# Altium schematic sheet 08-DDR3-256MX32.SchDoc
size 513 x 386 mm
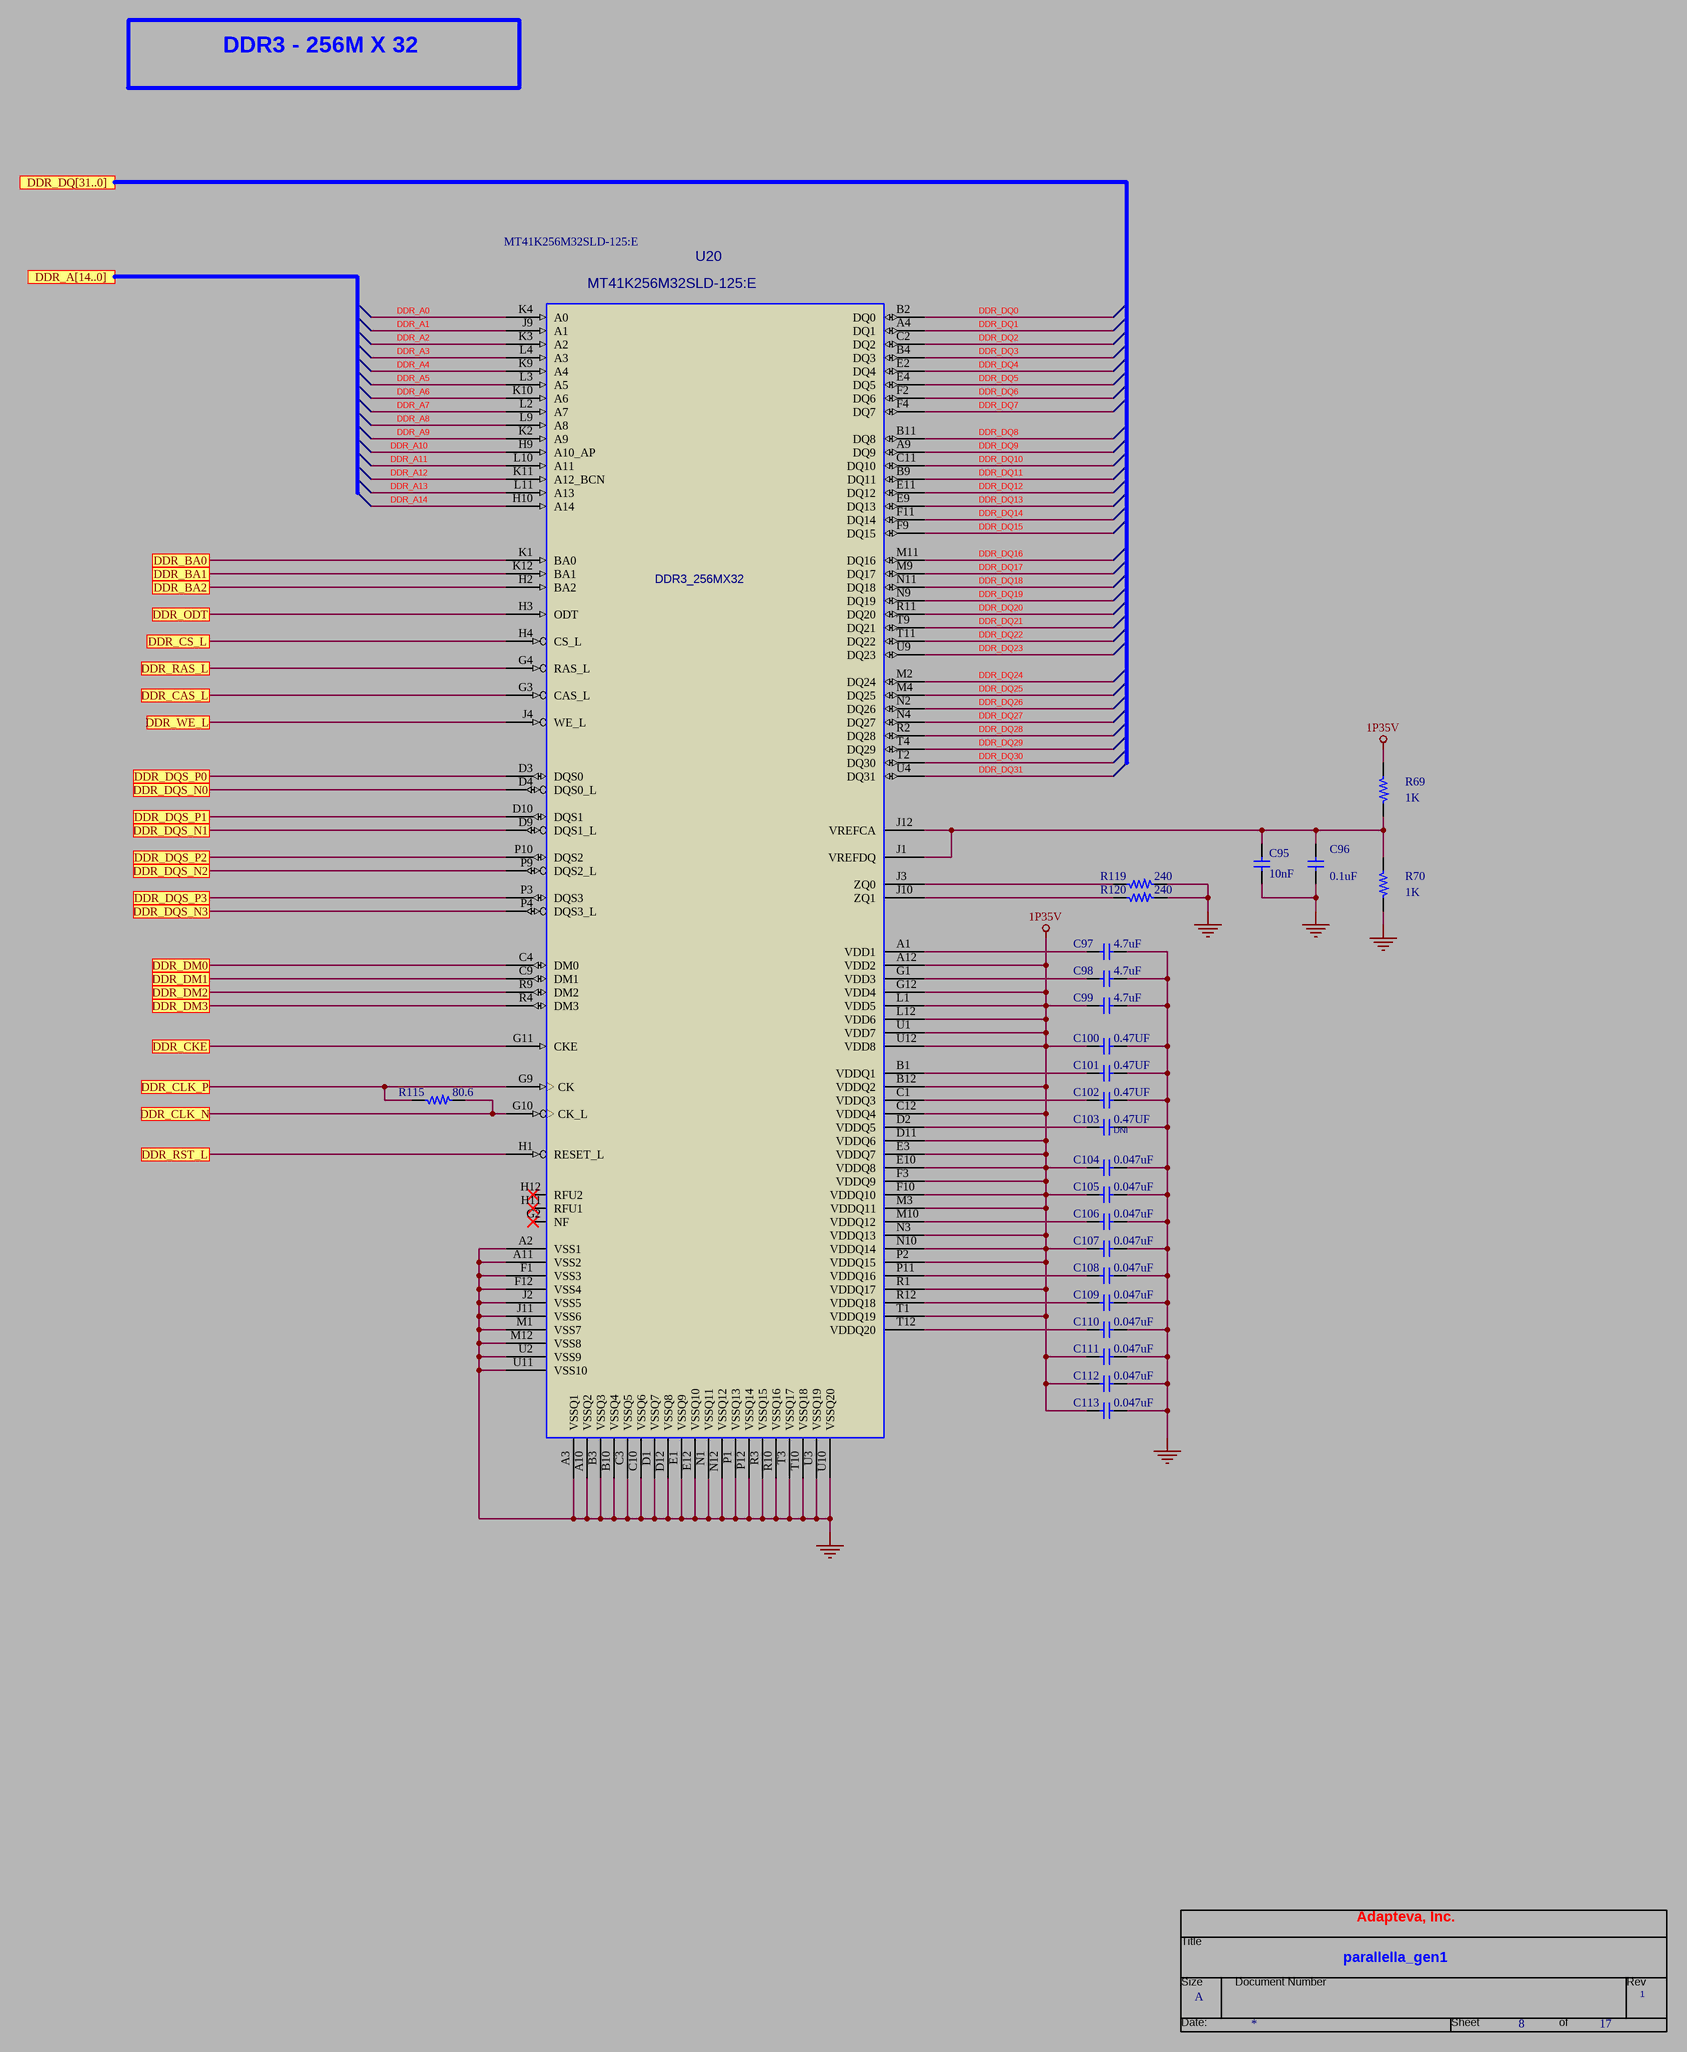
[diagram p0: 08-DDR3-256MX32.SchDoc]

## Parts
*  RevCode: 1  Title: parallella_gen1  Page Size: A  Page Number: 8  Page Count: 17  OrgAddr1: Adapteva, Inc.  (hidden comment: TitleBlock0)  (graphical)
C95  10nF  [C0402]
C96  0.1uF  [C0402]
C97  4.7uF  [C0402]
C98  4.7uF  [C0402]
C99  4.7uF  [C0402]
C100  0.47UF  [C0402]
C101  0.47UF  [C0402]
C102  0.47UF  [C0402]
C103  0.47UF  INSTALL: DNI  [C0402]
C104  0.047uF  [C0402]
C105  0.047uF  [C0402]
C106  0.047uF  [C0402]
C107  0.047uF  [C0402]
C108  0.047uF  [C0402]
C109  0.047uF  [C0402]
C110  0.047uF  [C0402]
C111  0.047uF  [C0402]
C112  0.047uF  [C0402]
C113  0.047uF  [C0402]
R69  1K  [R0402]
R70  1K  [R0402]
R115  80.6  [R0402]
R119  240  [R0402]
R120  240  [R0402]
U20  DDR3_256MX32  Vendor PN: MT41K256M32SLD-125:E  [FBGA136_11X14X1P1_P8MMP]

## Ports
DDR_A[14..0], DDR_BA0, DDR_BA1, DDR_BA2, DDR_CAS_L, DDR_CKE, DDR_CLK_N, DDR_CLK_P, DDR_CS_L, DDR_DM0, DDR_DM1, DDR_DM2, DDR_DM3, DDR_DQ[31..0], DDR_DQS_N0, DDR_DQS_N1, DDR_DQS_N2, DDR_DQS_N3, DDR_DQS_P0, DDR_DQS_P1, DDR_DQS_P2, DDR_DQS_P3, DDR_ODT, DDR_RAS_L, DDR_RST_L, DDR_WE_L

## Nets
1P35V: C99.1 C100.1 C104.1 C105.1 C107.1 C111.1 C112.1 C113.1 R69.1 U20.A12(VDD2) U20.B12(VDDQ2) U20.C12(VDDQ4) U20.D11(VDDQ6) U20.E3(VDDQ7) U20.E10(VDDQ8) U20.F3(VDDQ9) U20.F10(VDDQ10) U20.G12(VDD4) U20.L1(VDD5) U20.L12(VDD6) U20.M3(VDDQ11) U20.N3(VDDQ13) U20.N10(VDDQ14) U20.P2(VDDQ15) U20.R1(VDDQ17) U20.T1(VDDQ19) U20.U1(VDD7) U20.U12(VDD8)
GND: C95.2 C96.1 C97.2 C98.2 C99.2 C100.2 C101.2 C102.2 C103.2 C104.2 C105.2 C106.2 C107.2 C108.2 C109.2 C110.2 C111.2 C112.2 C113.2 R70.2 R119.2 R120.2 U20.A2(VSS1) U20.A3(VSSQ1) U20.A10(VSSQ2) U20.A11(VSS2) U20.B3(VSSQ3) U20.B10(VSSQ4) U20.C3(VSSQ5) U20.C10(VSSQ6) U20.D1(VSSQ7) U20.D12(VSSQ8) U20.E1(VSSQ9) U20.E12(VSSQ10) U20.F1(VSS3) U20.F12(VSS4) U20.J2(VSS5) U20.J11(VSS6) U20.M1(VSS7) U20.M12(VSS8) U20.N1(VSSQ11) U20.N12(VSSQ12) U20.P1(VSSQ13) U20.P12(VSSQ14) U20.R3(VSSQ15) U20.R10(VSSQ16) U20.T3(VSSQ17) U20.T10(VSSQ18) U20.U2(VSS9) U20.U3(VSSQ19) U20.U10(VSSQ20) U20.U11(VSS10)
DDR_A0: U20.K4(A0)
DDR_A1: U20.J9(A1)
DDR_A2: U20.K3(A2)
DDR_A3: U20.L4(A3)
DDR_A4: U20.K9(A4)
DDR_A5: U20.L3(A5)
DDR_A6: U20.K10(A6)
DDR_A7: U20.L2(A7)
DDR_A8: U20.L9(A8)
DDR_A9: U20.K2(A9)
DDR_A10: U20.H9(A10_AP)
DDR_A11: U20.L10(A11)
DDR_A12: U20.K11(A12_BCN)
DDR_A13: U20.L11(A13)
DDR_A14: U20.H10(A14)
DDR_BA0: U20.K1(BA0) ; port DDR_BA0
DDR_BA1: U20.K12(BA1) ; port DDR_BA1
DDR_BA2: U20.H2(BA2) ; port DDR_BA2
DDR_CAS_L: U20.G3(CAS_L) ; port DDR_CAS_L
DDR_CKE: U20.G11(CKE) ; port DDR_CKE
DDR_CLK_N: R115.2 U20.G10(CK_L) ; port DDR_CLK_N
DDR_CLK_P: R115.1 U20.G9(CK) ; port DDR_CLK_P
DDR_CS_L: U20.H4(CS_L) ; port DDR_CS_L
DDR_DM0: U20.C4(DM0) ; port DDR_DM0
DDR_DM1: U20.C9(DM1) ; port DDR_DM1
DDR_DM2: U20.R9(DM2) ; port DDR_DM2
DDR_DM3: U20.R4(DM3) ; port DDR_DM3
DDR_DQ0: U20.B2(DQ0)
DDR_DQ1: U20.A4(DQ1)
DDR_DQ2: U20.C2(DQ2)
DDR_DQ3: U20.B4(DQ3)
DDR_DQ4: U20.E2(DQ4)
DDR_DQ5: U20.E4(DQ5)
DDR_DQ6: U20.F2(DQ6)
DDR_DQ7: U20.F4(DQ7)
DDR_DQ8: U20.B11(DQ8)
DDR_DQ9: U20.A9(DQ9)
DDR_DQ10: U20.C11(DQ10)
DDR_DQ11: U20.B9(DQ11)
DDR_DQ12: U20.E11(DQ12)
DDR_DQ13: U20.E9(DQ13)
DDR_DQ14: U20.F11(DQ14)
DDR_DQ15: U20.F9(DQ15)
DDR_DQ16: U20.M11(DQ16)
DDR_DQ17: U20.M9(DQ17)
DDR_DQ18: U20.N11(DQ18)
DDR_DQ19: U20.N9(DQ19)
DDR_DQ20: U20.R11(DQ20)
DDR_DQ21: U20.T9(DQ21)
DDR_DQ22: U20.T11(DQ22)
DDR_DQ23: U20.U9(DQ23)
DDR_DQ24: U20.M2(DQ24)
DDR_DQ25: U20.M4(DQ25)
DDR_DQ26: U20.N2(DQ26)
DDR_DQ27: U20.N4(DQ27)
DDR_DQ28: U20.R2(DQ28)
DDR_DQ29: U20.T4(DQ29)
DDR_DQ30: U20.T2(DQ30)
DDR_DQ31: U20.U4(DQ31)
DDR_DQS_N0: U20.D4(DQS0_L) ; port DDR_DQS_N0
DDR_DQS_N1: U20.D9(DQS1_L) ; port DDR_DQS_N1
DDR_DQS_N2: U20.P9(DQS2_L) ; port DDR_DQS_N2
DDR_DQS_N3: U20.P4(DQS3_L) ; port DDR_DQS_N3
DDR_DQS_P0: U20.D3(DQS0) ; port DDR_DQS_P0
DDR_DQS_P1: U20.D10(DQS1) ; port DDR_DQS_P1
DDR_DQS_P2: U20.P10(DQS2) ; port DDR_DQS_P2
DDR_DQS_P3: U20.P3(DQS3) ; port DDR_DQS_P3
DDR_ODT: U20.H3(ODT) ; port DDR_ODT
DDR_RAS_L: U20.G4(RAS_L) ; port DDR_RAS_L
DDR_RST_L: U20.H1(RESET_L) ; port DDR_RST_L
DDR_WE_L: U20.J4(WE_L) ; port DDR_WE_L
NetC95_1: C95.1 C96.2 R69.2 R70.1 U20.J1(VREFDQ) U20.J12(VREFCA)
NetC97_1: C97.1 U20.A1(VDD1)
NetC98_1: C98.1 U20.G1(VDD3)
NetC101_1: C101.1 U20.B1(VDDQ1)
NetC102_1: C102.1 U20.C1(VDDQ3)
NetC103_1: C103.1 U20.D2(VDDQ5)
NetC106_1: C106.1 U20.M10(VDDQ12)
NetC108_1: C108.1 U20.P11(VDDQ16)
NetC109_1: C109.1 U20.R12(VDDQ18)
NetC110_1: C110.1 U20.T12(VDDQ20)
NetR119_1: R119.1 U20.J3(ZQ0)
NetR120_1: R120.1 U20.J10(ZQ1)

Not connected (* = marked no-connect by the designer): U20 G2(NF)* H11(RFU1)* H12(RFU2)*

## Notes on the sheet
- DDR3 - 256M X 32
- (in symbol TitleBlock0) Title; Size; Document Number; Rev; Date:; Sheet; of

## Library data of the parts
C95 = CAP0402_10NF_X7R_16V: CAP, 0402, 10NF, X7R, 16V; MFG PART NO: C1005X7R1C103K; MFG: TDK; ALT_SYMBOLS: C0402_BGA; Vendor: TDK; Vendor PN: C1005X7R1C103K; PCB Footprint: C0402
C96 = CAP0402_0P1UF_X5R_35V: CAP, 0402, 0.1UF, X5R, 35V; ALT_SYMBOLS: C0402_BGA; Vendor PN: GMK105BJ104KV-F; Vendor: TAIYO YUDEN; DEVICE: CAP0402_0P1UF_X5R_35V; MFG PART NO: GMK105BJ104KV-F; MFG: TAIYO YUDEN; PCB Footprint: C0402
C97-C99 = CAP0402_4P7UF_X5R: CAP, 0402, 4.7UF, X5R, 6.3V; MFG PART NO: C1005X5R0J475K; MFG: TDK; ALT_SYMBOLS: C0402_BGA; DEVICE: CAP0402_4P7UF_X5R; Vendor: TDK; Vendor PN: C1005X5R0J475K; PCB Footprint: C0402
C100-C103 = CAP0402_0P47UF_X5R: CAP, 0402, 0.47UF, X5R, 16V; MFG PART NO: C1005X5R1C474K; MFG: TDK; ALT_SYMBOLS: C0402_BGA; DEVICE: CAP0402_0P47UF_X5R; Vendor: TDK; Vendor PN: C1005X5R1C474K; PCB Footprint: C0402
C104-C113 = CAP0402_0P047UF_X5R: CAP, 0402, 0.047UF, X5R, 25V; MFG PART NO: C1005X5R1E473M; MFG: TDK; DEVICE: CAP0402_0P047UF_X5R; Vendor: TDK; Vendor PN: C1005X5R1E473M; PCB Footprint: C0402
R69 R70 = RES0402_1K: RES, 0402, 1K; MFG PART NO: CRCW04021K00FKED; ALT_SYMBOLS: R0402_BGA; MFG: VISHAY; Vendor: VISHAY/DALE; DEVICE: RES0402_1K; Vendor PN: CRCW04021K00FKED; PCB Footprint: R0402
R115 = RES0402_80P6: RES, 0402, 80.6, 1%; MFG PART NO: CRCW040280R6FKED; MFG: VISHAY; Vendor: VISHAY/DALE; ALT_SYMBOLS: R0402_BGA; DEVICE: RES0402_80P6; Vendor PN: CRCW040280R6FKED; PCB Footprint: R0402
R119 R120 = RES0402_240: RES, 0402, 240, 1%; MFG PART NO: CRCW0402240RFKED; ALT_SYMBOLS: R0402_BGA; MFG: VISHAY; Vendor: VISHAY/DALE; DEVICE: RES0402_240; Vendor PN: CRCW0402240RFKED; PCB Footprint: R0402
U20 = DDR3_256MX32: IC, DDR3, 8Gb, 256M32, BGA136; Vendor: MICRON; DEVICE: DDR3_256MX32; Supplier 1: Avnet; Supplier Part Number 1: MT41K256M32SLD-125:E
* = TitleBlock0: Page Create Date: March  8, 1995; Page Modify Date: *